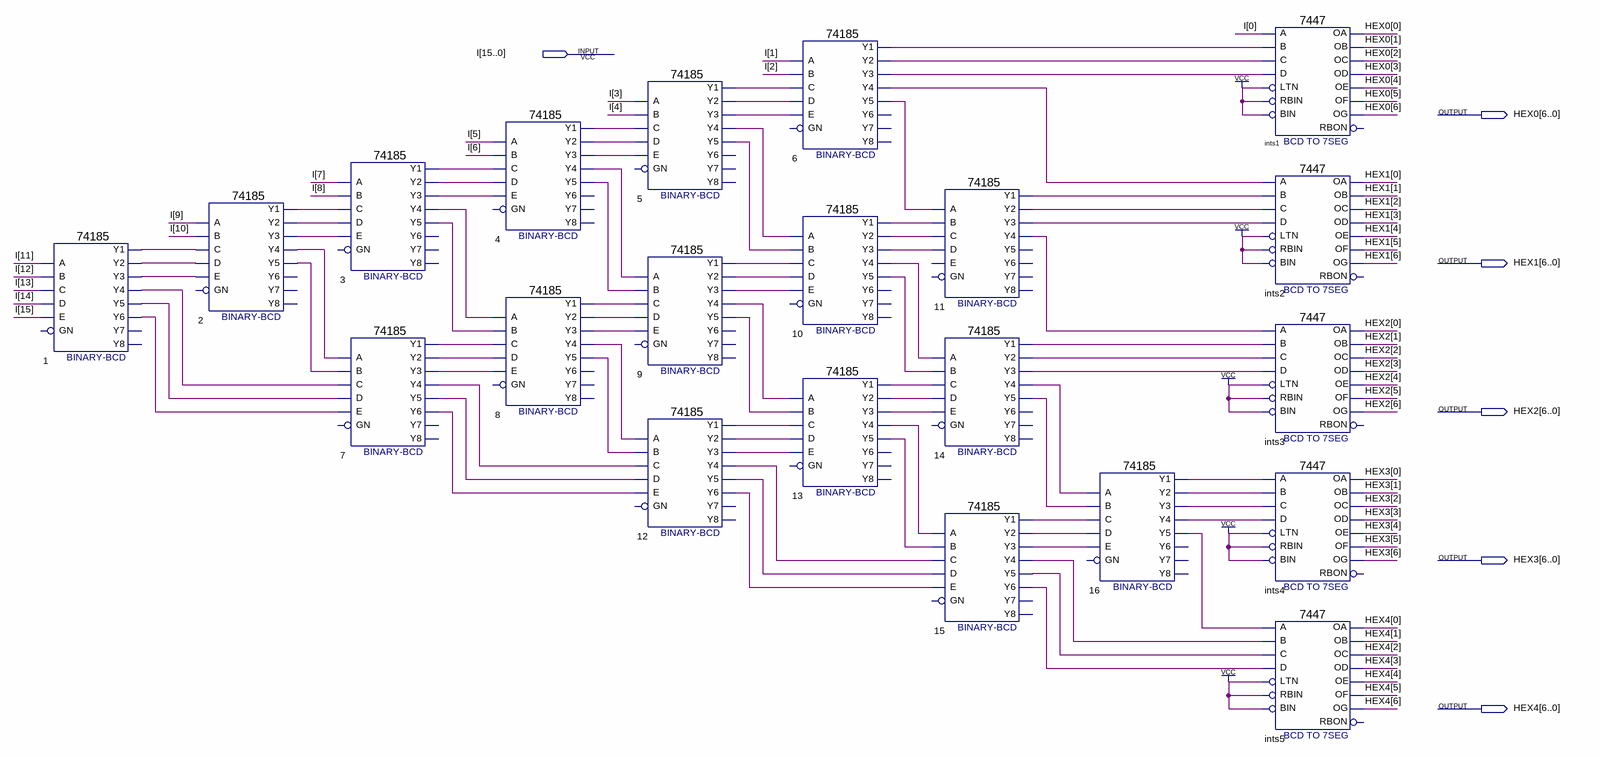
[diagram p0: schematic sheet]
// Quartus schematic B-BCD-L_16.bdf as structural Verilog: 21 symbols, 6 pins
module \B-BCD-L_16  (
  input  [15:0] I,
  output [6:0] HEX0,
  output [6:0] HEX1,
  output [6:0] HEX2,
  output [6:0] HEX3,
  output [6:0] HEX4
);

  wire n1_y1, n1_y2, n1_y3, n1_y4, n1_y5, n1_y6, n2_y1, n2_y2, n2_y3, n2_y4, n2_y5, n3_y1, n3_y2, n3_y3,
       n3_y4, n3_y5, n4_y1, n4_y2, n4_y3, n4_y4, n4_y5, n5_y1, n5_y2, n5_y3, n5_y4, n5_y5, n6_y1, n6_y2,
       n6_y3, n6_y4, n6_y5, n7_y1, n7_y2, n7_y3, n7_y4, n7_y5, n7_y6, n8_y1, n8_y2, n8_y3, n8_y4, n8_y5,
       n9_y1, n9_y2, n9_y3, n9_y4, n9_y5, n10_y1, n10_y2, n10_y3, n10_y4, n10_y5, n11_y1, n11_y2, n11_y3,
       n11_y4, n12_y1, n12_y2, n12_y3, n12_y4, n12_y5, n12_y6, n13_y1, n13_y2, n13_y3, n13_y4, n13_y5,
       n14_y1, n14_y2, n14_y3, n14_y4, n14_y5, n15_y1, n15_y2, n15_y3, n15_y4, n15_y5, n15_y6, n16_y1,
       n16_y2, n16_y3, n16_y4, n16_y5;

  \74185  u_1 (
    .A(I[11]), .B(I[12]), .D(I[14]), .C(I[13]), .E(I[15]), .Y1(n1_y1), .Y3(n1_y3), .Y2(n1_y2), .Y5(n1_y5),
    .Y4(n1_y4), .Y6(n1_y6));  // open: GN, Y8, Y7
  \74185  u_2 (
    .A(I[9]), .B(I[10]), .D(n1_y2), .C(n1_y1), .E(n1_y3), .Y1(n2_y1), .Y3(n2_y3), .Y2(n2_y2), .Y5(n2_y5),
    .Y4(n2_y4));  // open: GN, Y6, Y8, Y7
  \74185  u_3 (
    .A(I[7]), .B(I[8]), .D(n2_y2), .C(n2_y1), .E(n2_y3), .Y1(n3_y1), .Y3(n3_y3), .Y2(n3_y2), .Y5(n3_y5),
    .Y4(n3_y4));  // open: GN, Y6, Y8, Y7
  \74185  u_7 (
    .A(n2_y4), .B(n2_y5), .D(n1_y5), .C(n1_y4), .E(n1_y6), .Y1(n7_y1), .Y3(n7_y3), .Y2(n7_y2), .Y5(n7_y5),
    .Y4(n7_y4), .Y6(n7_y6));  // open: GN, Y8, Y7
  \74185  u_4 (
    .A(I[5]), .B(I[6]), .D(n3_y2), .C(n3_y1), .E(n3_y3), .Y1(n4_y1), .Y3(n4_y3), .Y2(n4_y2), .Y5(n4_y5),
    .Y4(n4_y4));  // open: GN, Y6, Y8, Y7
  \74185  u_8 (
    .A(n3_y4), .B(n3_y5), .D(n7_y2), .C(n7_y1), .E(n7_y3), .Y1(n8_y1), .Y3(n8_y3), .Y2(n8_y2), .Y5(n8_y5),
    .Y4(n8_y4));  // open: GN, Y6, Y8, Y7
  \74185  u_5 (
    .A(I[3]), .B(I[4]), .D(n4_y2), .C(n4_y1), .E(n4_y3), .Y1(n5_y1), .Y3(n5_y3), .Y2(n5_y2), .Y5(n5_y5),
    .Y4(n5_y4));  // open: GN, Y6, Y8, Y7
  \74185  u_9 (
    .A(n4_y4), .B(n4_y5), .D(n8_y2), .C(n8_y1), .E(n8_y3), .Y1(n9_y1), .Y3(n9_y3), .Y2(n9_y2), .Y5(n9_y5),
    .Y4(n9_y4));  // open: GN, Y6, Y8, Y7
  \74185  u_12 (
    .A(n8_y4), .B(n8_y5), .D(n7_y5), .C(n7_y4), .E(n7_y6), .Y1(n12_y1), .Y3(n12_y3), .Y2(n12_y2),
    .Y5(n12_y5), .Y4(n12_y4), .Y6(n12_y6));  // open: GN, Y8, Y7
  \74185  u_6 (
    .A(I[1]), .B(I[2]), .D(n5_y2), .C(n5_y1), .E(n5_y3), .Y1(n6_y1), .Y3(n6_y3), .Y2(n6_y2), .Y5(n6_y5),
    .Y4(n6_y4));  // open: GN, Y6, Y8, Y7
  \74185  u_10 (
    .A(n5_y4), .B(n5_y5), .D(n9_y2), .C(n9_y1), .E(n9_y3), .Y1(n10_y1), .Y3(n10_y3), .Y2(n10_y2),
    .Y5(n10_y5), .Y4(n10_y4));  // open: GN, Y6, Y8, Y7
  \74185  u_13 (
    .A(n9_y4), .B(n9_y5), .D(n12_y2), .C(n12_y1), .E(n12_y3), .Y1(n13_y1), .Y3(n13_y3), .Y2(n13_y2),
    .Y5(n13_y5), .Y4(n13_y4));  // open: GN, Y6, Y8, Y7
  \74185  u_11 (
    .A(n6_y5), .B(n10_y1), .D(n10_y3), .C(n10_y2), .Y1(n11_y1), .Y3(n11_y3), .Y2(n11_y2), .Y4(n11_y4));  // open: E, GN, Y5, Y6, Y8, Y7
  \74185  u_14 (
    .A(n10_y4), .B(n10_y5), .D(n13_y2), .C(n13_y1), .E(n13_y3), .Y1(n14_y1), .Y3(n14_y3), .Y2(n14_y2),
    .Y5(n14_y5), .Y4(n14_y4));  // open: GN, Y6, Y8, Y7
  \74185  u_15 (
    .A(n13_y4), .B(n13_y5), .D(n12_y5), .C(n12_y4), .E(n12_y6), .Y1(n15_y1), .Y3(n15_y3), .Y2(n15_y2),
    .Y5(n15_y5), .Y4(n15_y4), .Y6(n15_y6));  // open: GN, Y8, Y7
  \74185  u_16 (
    .A(n14_y4), .B(n14_y5), .D(n15_y2), .C(n15_y1), .E(n15_y3), .Y1(n16_y1), .Y3(n16_y3), .Y2(n16_y2),
    .Y5(n16_y5), .Y4(n16_y4));  // open: GN, Y6, Y8, Y7
  \7447  ints1 (
    .LTN(1'b1), .B(n6_y1), .C(n6_y2), .D(n6_y3), .RBIN(1'b1), .BIN(1'b1), .A(I[0]), .OB(HEX0[1]),
    .OC(HEX0[2]), .OE(HEX0[4]), .OD(HEX0[3]), .OF(HEX0[5]), .OG(HEX0[6]), .OA(HEX0[0]));  // open: RBON
  \7447  ints2 (
    .LTN(1'b1), .B(n11_y1), .C(n11_y2), .D(n11_y3), .RBIN(1'b1), .BIN(1'b1), .A(n6_y4), .OB(HEX1[1]),
    .OC(HEX1[2]), .OE(HEX1[4]), .OD(HEX1[3]), .OF(HEX1[5]), .OG(HEX1[6]), .OA(HEX1[0]));  // open: RBON
  \7447  ints3 (
    .LTN(1'b1), .B(n14_y1), .C(n14_y2), .D(n14_y3), .RBIN(1'b1), .BIN(1'b1), .A(n11_y4), .OB(HEX2[1]),
    .OC(HEX2[2]), .OE(HEX2[4]), .OD(HEX2[3]), .OF(HEX2[5]), .OG(HEX2[6]), .OA(HEX2[0]));  // open: RBON
  \7447  ints4 (
    .LTN(1'b1), .B(n16_y2), .C(n16_y3), .D(n16_y4), .RBIN(1'b1), .BIN(1'b1), .A(n16_y1), .OB(HEX3[1]),
    .OC(HEX3[2]), .OE(HEX3[4]), .OD(HEX3[3]), .OF(HEX3[5]), .OG(HEX3[6]), .OA(HEX3[0]));  // open: RBON
  \7447  ints5 (
    .LTN(1'b1), .B(n15_y4), .C(n15_y5), .D(n15_y6), .RBIN(1'b1), .BIN(1'b1), .A(n16_y5), .OB(HEX4[1]),
    .OC(HEX4[2]), .OE(HEX4[4]), .OD(HEX4[3]), .OF(HEX4[5]), .OG(HEX4[6]), .OA(HEX4[0]));  // open: RBON
endmodule
